# Altium schematic sheet 2.SIM.SchDoc: 2.SIM_Interface
size A4; DrawnBy: Mason; Revision: V001; SheetNumber: 2; SheetTotal: 2; Team: Gateway; ProjectName: AM_Starter_kit_V001
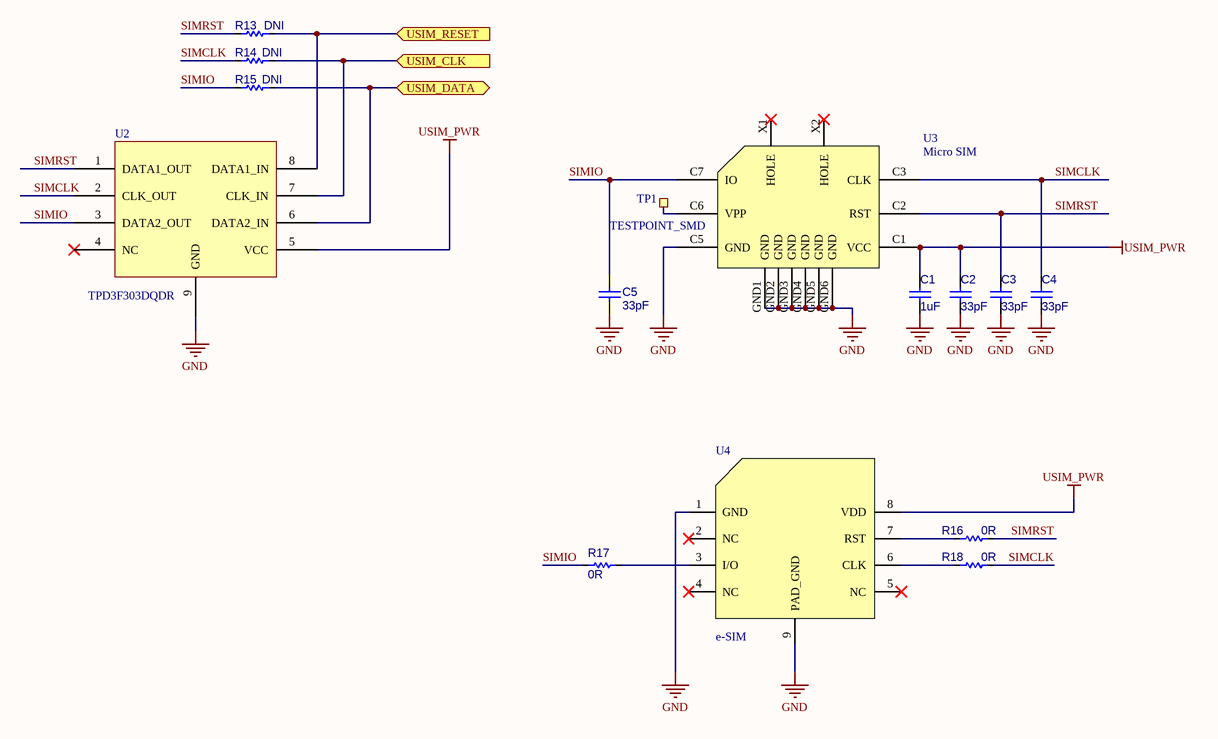
[diagram p0: 2.SIM.SchDoc]

## Parts
C1  1uF  [CAP-0402]
C2  33pF  [CAP-0402]
C3  33pF  [CAP-0402]
C4  33pF  [CAP-0402]
C5  33pF  [CAP-0402]
R13  DNI  [RES-0402]
R14  DNI  [RES-0402]
R15  DNI  [RES-0402]
R16  0R  [RES-0402]
R17  0R  [RES-0402]
R18  0R  [RES-0402]
TP1  TESTPOINT_SMD  [TP(SMD)-1PI]
U2  TPD3F303DQDR  [PWSON08(0.4/1.45X1.8)]
U3  Micro SIM  [0786463001]
U4  e-SIM  [SON08(1.27/6X5)]

## Ports
USIM_CLK (in), USIM_DATA (bidir), USIM_RESET (in)

## Nets
GND: C1.1 C2.1 C3.1 C4.1 C5.1 U2.9(GND) U3.C5(GND) U3.GND1(GND) U3.GND2(GND) U3.GND3(GND) U3.GND4(GND) U3.GND5(GND) U3.GND6(GND) U4.1(GND) U4.9(PAD_GND)
USIM_PWR: C1.2 C2.2 U2.5(VCC) U3.C1(VCC) U4.8(VDD)
SIMCLK: C4.2 R14.2 R18.2 U2.2(CLK_OUT) U3.C3(CLK)
SIMIO: C5.2 R15.2 R17.1 U2.3(DATA2_OUT) U3.C7(IO)
SIMRST: C3.2 R13.2 R16.2 U2.1(DATA1_OUT) U3.C2(RST)
USIM_CLK: R14.1 U2.7(CLK_IN) ; port USIM_CLK
USIM_DATA: R15.1 U2.6(DATA2_IN) ; port USIM_DATA
USIM_RESET: R13.1 U2.8(DATA1_IN) ; port USIM_RESET
NetR16_1: R16.1 U4.7(RST)
NetR17_2: R17.2 U4.3(I/O)
NetR18_1: R18.1 U4.6(CLK)
NetTP1_1: TP1.1(TETSPOINT) U3.C6(VPP)

Not connected (* = marked no-connect by the designer): U2 4(NC)*; U3 X1(HOLE)* X2(HOLE)*; U4 2(NC)* 4(NC)* 5(NC)*

## Notes on the sheet
- Title
- Size:
- Date:
- A4
- Number:
- Revision:
- Sheet
- of
- WIZnet Co., Ltd.
- 5F, Humax Village
- Hwangseaul-ro, Bundang-gu
- Seongnam-si, Gyeongi-do
- South Korea
- Team:
- Drawn By:

## Library data of the parts
C1-C5 = CAP-0402: Ceramic CAP 0402(1005)
R13-R18 = RES-0402
TP1 = TESTPOINT_SMD: TEST POINT
U2 = TPD3F303DQDR: ESD Protection SIM
U3 = Micro SIM: Micro SIM SMT 1.45mm Push/Pull